# EAGLE schematic ESP01-lights (EAGLE 6.6.0)
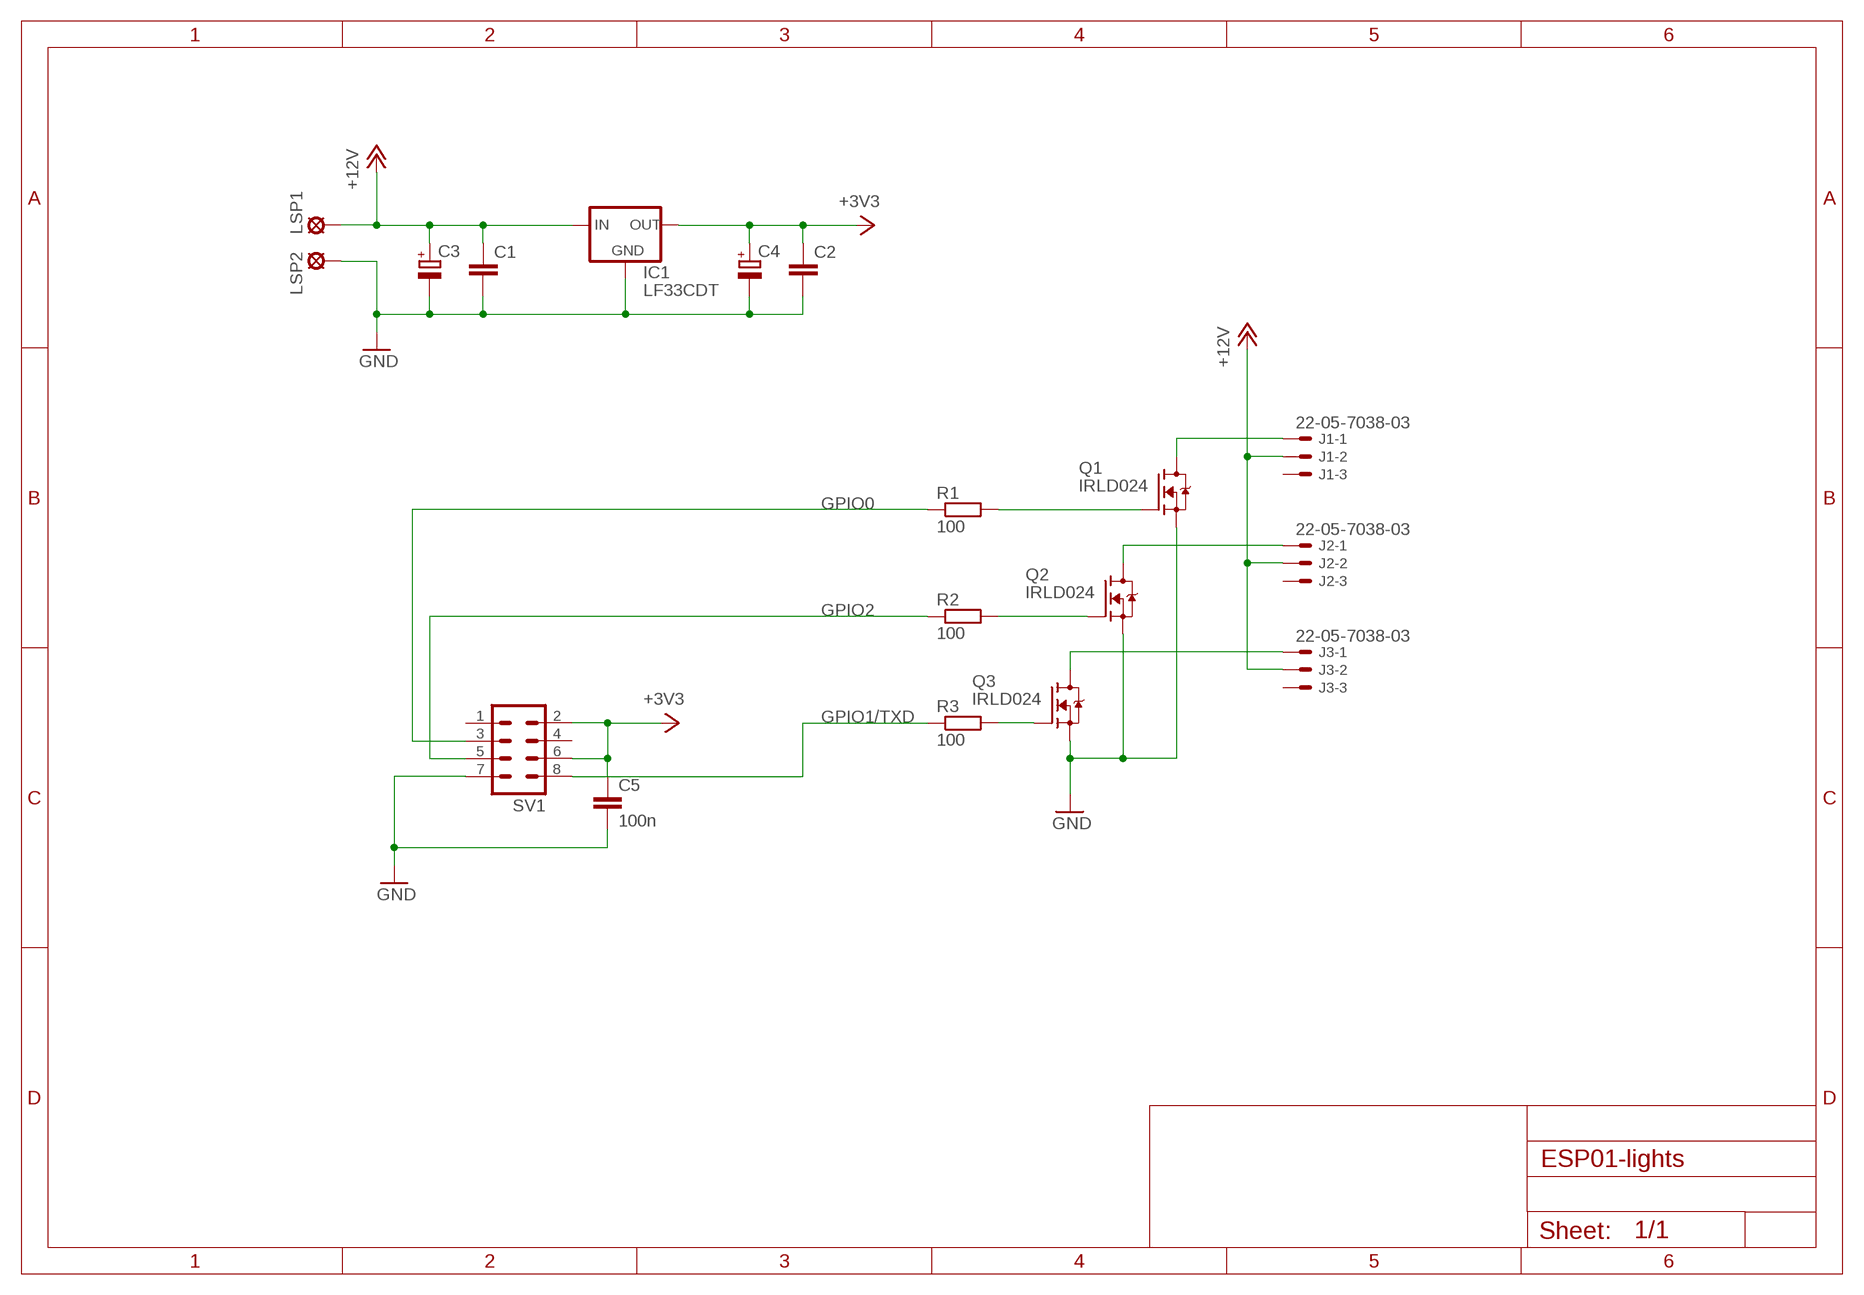
[diagram p0: schematic, sheet 1]

## Parts
C1  C-EUC0805  [C0805]
C2  C-EUC0805  [C0805]
C3  CPOL-EUSMCA  [SMC_A]
C4  CPOL-EUSMCA  [SMC_A]
C5  100n  C-EUC0805  [C0805]
IC1  LF33CDT  LP2950CDT-3.3  [DPACK]
J1  22-05-7038-03  [7395-03]
J2  22-05-7038-03  [7395-03]
J3  22-05-7038-03  [7395-03]
LSP1  LSP10  [LSP10]
LSP2  LSP10  [LSP10]
Q1  IRLD024  SPW47N60S5  [P-TO247]
Q2  IRLD024  SPW47N60S5  [P-TO247]
Q3  IRLD024  SPW47N60S5  [P-TO247]
R1  100  R-EU_0204/2V  [0204V]
R2  100  R-EU_0204/2V  [0204V]
R3  100  R-EU_0204/2V  [0204V]
SV1  MA04-2  [MA04-2]

## Nets
+3V3: C2.1 C4.+ C5.1 IC1.3(OUT) SV1.2 SV1.6
+12V: C1.1 C3.+ IC1.1(IN) J1.2 J2.2 J3.2 LSP1.MP
GND: C1.2 C2.2 C3.- C4.- C5.2 IC1.4(GND) LSP2.MP Q1.3(S) Q2.3(S) Q3.3(S) SV1.7
GPIO0: R1.1 SV1.3
GPIO1/TXD: R3.1 SV1.8
GPIO2: R2.1 SV1.5
N$1: J1.1 Q1.2(D)
N$2: J2.1 Q2.2(D)
N$3: J3.1 Q3.2(D)
N$6: Q1.1(G) R1.2
N$7: Q2.1(G) R2.2
N$8: Q3.1(G) R3.2
Unconnected: J1.3 J2.3 J3.3 SV1.1 SV1.4

## Library data of the parts
C1 C2 C5 = rcl:C-EU: CAPACITOR, European symbol
C3 C4 = rcl:CPOL-EU: POLARIZED CAPACITOR, European symbol
IC1 = v-reg:LP2950?*: Source: http://cache.national.com/ds/LP/LP2950.pdf
J1-J3 = con-molex:22-?-03: CONNECTOR wire to board 2.54 mm (.1 inch) pitch header; OC_FARNELL: unknown; OC_NEWARK: unknown
LSP1 LSP2 = solpad:LSP10: SOLDER PAD drill 1.0 mm, distributor Buerklin, 12H555
Q1-Q3 = transistor-fet:SPW47N60S5: Cool MOS Power Transistor
R1-R3 = rcl:R-EU_: RESISTOR, European symbol
SV1 = con-lstb:MA04-2: PIN HEADER; OC_FARNELL: unknown; OC_NEWARK: unknown